# Altium schematic sheet Buck 5V.SchDoc
size 420 x 297 mm; Revision: 1.0.0; SheetNumber: 5; SheetTotal: 15
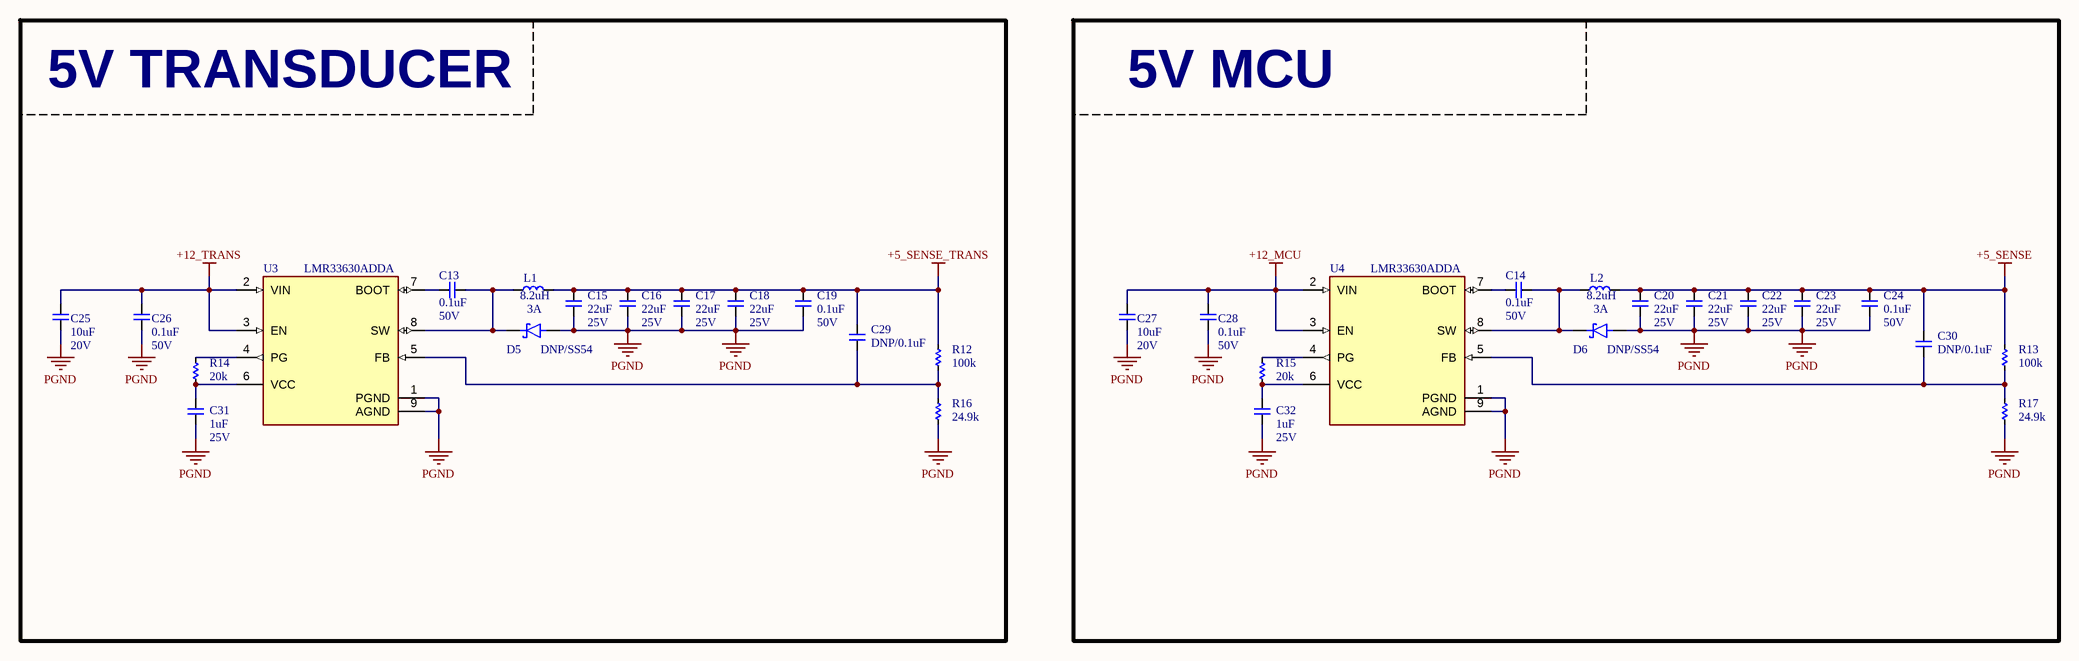
[diagram p0: Buck 5V.SchDoc]

## Parts
C13  0.1uF  Voltage: 50V  [CAP_C_1608X80]
C14  0.1uF  Voltage: 50V  [CAP_C_1608X80]
C15  22uF  Voltage: 25V  [CAP_C_2012X110]
C16  22uF  Voltage: 25V  [CAP_C_2012X110]
C17  22uF  Voltage: 25V  [CAP_C_2012X110]
C18  22uF  Voltage: 25V  [CAP_C_2012X110]
C19  0.1uF  Voltage: 50V  [CAP_C_1608X80]
C20  22uF  Voltage: 25V  [CAP_C_2012X110]
C21  22uF  Voltage: 25V  [CAP_C_2012X110]
C22  22uF  Voltage: 25V  [CAP_C_2012X110]
C23  22uF  Voltage: 25V  [CAP_C_2012X110]
C24  0.1uF  Voltage: 50V  [CAP_C_1608X80]
C25  10uF  Voltage: 20V  [CAP_C_2012X110]
C26  0.1uF  Voltage: 50V  [CAP_C_1608X80]
C27  10uF  Voltage: 20V  [CAP_C_2012X110]
C28  0.1uF  Voltage: 50V  [CAP_C_1608X80]
C29  Voltage: DNP/0.1uF  [CAP_C_1608X80]  (hidden comment: DNP/100nF)
C30  Voltage: DNP/0.1uF  [CAP_C_1608X80]  (hidden comment: DNP/100nF)
C31  1uF  Voltage: 25V  [CAP_C_1608X80]
C32  1uF  Voltage: 25V  [CAP_C_1608X80]
D5  DNP/SS54  [DO-214AC_SMA]
D6  DNP/SS54  [DO-214AC_SMA]
L1  8.2uH  Voltage: 3A  [INDUCTOR 6363]
L2  8.2uH  Voltage: 3A  [INDUCTOR 6363]
R12  100k  [RES_C_1608X60]
R13  100k  [RES_C_1608X60]
R14  20k  [RES_C_1608X60]
R15  20k  [RES_C_1608X60]
R16  24.9k  [RES_C_1608X60]
R17  24.9k  [RES_C_1608X60]
U3  LMR33630ADDA  [HSOIC_8]
U4  LMR33630ADDA  [HSOIC_8]

## Blocks framed on the sheet
5V TRANSDUCER: C13 C15-C19 C25 C26 C29 C31 D5 L1 R12 R14 R16 U3
5V MCU: C14 C20-C24 C27 C28 C30 C32 D6 L2 R13 R15 R17 U4

## Nets
+5_SENSE: C20.1 C21.1 C22.1 C23.1 C24.1 C30.1 L2.2 R13.1
+5_SENSE_TRANS: C15.1 C16.1 C17.1 C18.1 C19.1 C29.1 L1.2 R12.1
+12_MCU: C27.1 C28.1 U4.2(VIN) U4.3(EN)
+12_TRANS: C25.1 C26.1 U3.2(VIN) U3.3(EN)
PGND: C15.2 C16.2 C17.2 C18.2 C19.2 C20.2 C21.2 C22.2 C23.2 C24.2 C25.2 C26.2 C27.2 C28.2 C31.2 C32.2 D5.2(A) D6.2(A) R16.2 R17.2 U3.1(PGND) U3.9(AGND) U4.1(PGND) U4.9(AGND)
NetC13_1: C13.1 D5.1(K) L1.1 U3.8(SW)
NetC13_2: C13.2 U3.7(BOOT)
NetC14_1: C14.1 D6.1(K) L2.1 U4.8(SW)
NetC14_2: C14.2 U4.7(BOOT)
NetC29_2: C29.2 R12.2 R16.1 U3.5(FB)
NetC30_2: C30.2 R13.2 R17.1 U4.5(FB)
NetC31_1: C31.1 R14.2 U3.6(VCC)
NetC32_1: C32.1 R15.2 U4.6(VCC)
NetR14_1: R14.1 U3.4(PG)
NetR15_1: R15.1 U4.4(PG)

## Notes on the sheet
- Project:
- DAL_PDU
- Sub-system:
- IGRVT-50
- Design by:
- KIEN HOANG
- BAO BUI
- Sheet title:
- Sheet
- A3
- of
- Checked by:
- Approved by:
- VU PHAM
- Revision:
- Document No:
- Size:
- Date:

## Library data of the parts
C13-C32 = _CAP_C_2: CAP
D5 D6 = DIODE SCHOTTKY
L1 L2 = Inductor
R12-R17 = _RES_B_2_2: RES